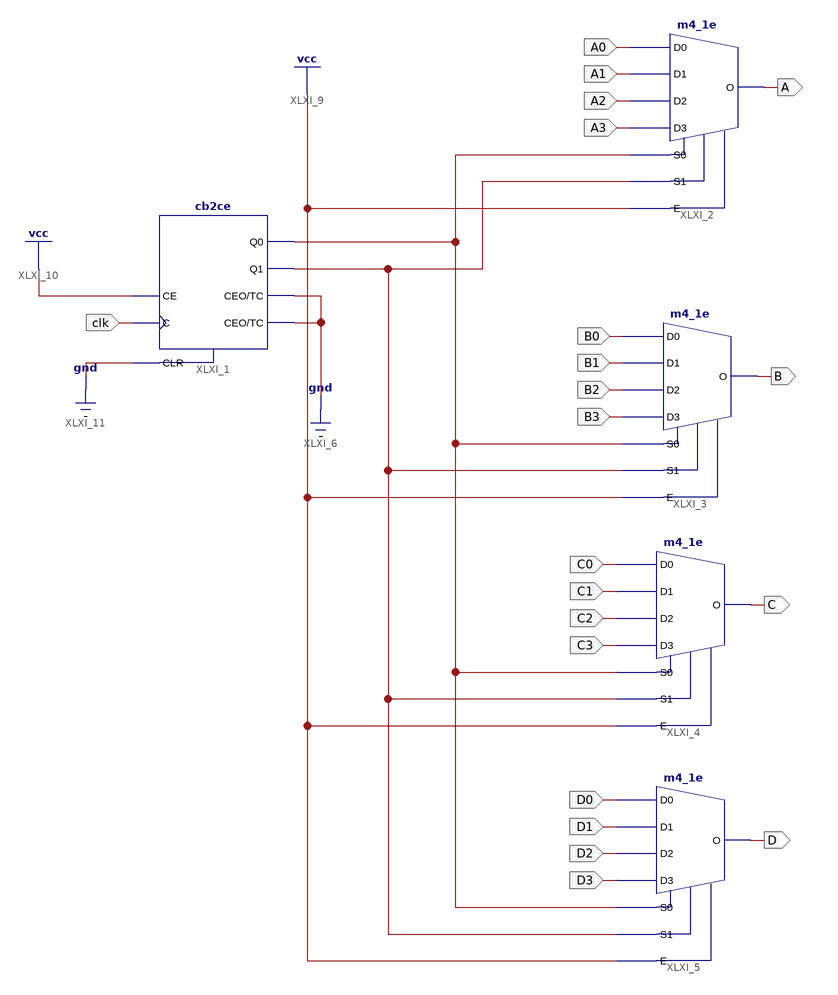
[diagram p0: schematic sheet 1]
// Xilinx ISE schematic mux7segment.sch (spartan6) as structural Verilog: 5 symbols, 21 ports
module mux7segment (
  input  clk,
  input  A0,
  input  A1,
  input  A2,
  input  A3,
  input  B0,
  input  B1,
  input  B2,
  input  B3,
  input  C0,
  input  C1,
  input  C2,
  input  C3,
  input  D0,
  input  D1,
  input  D2,
  input  D3,
  output A,
  output B,
  output C,
  output D
);

  wire XLXN_6, XLXN_7;

  m4_1e XLXI_2 (.D0(A0), .D1(A1), .D2(A2), .D3(A3), .E(1'b1), .S0(XLXN_6), .S1(XLXN_7), .O(A));
  m4_1e XLXI_3 (.D0(B0), .D1(B1), .D2(B2), .D3(B3), .E(1'b1), .S0(XLXN_6), .S1(XLXN_7), .O(B));
  m4_1e XLXI_4 (.D0(C0), .D1(C1), .D2(C2), .D3(C3), .E(1'b1), .S0(XLXN_6), .S1(XLXN_7), .O(C));
  m4_1e XLXI_5 (.D0(D0), .D1(D1), .D2(D2), .D3(D3), .E(1'b1), .S0(XLXN_6), .S1(XLXN_7), .O(D));
  cb2ce XLXI_1 (.C(clk), .CE(1'b1), .CLR(1'b0), .CEO(1'b0), .Q0(XLXN_6), .Q1(XLXN_7), .TC(1'b0));
endmodule
